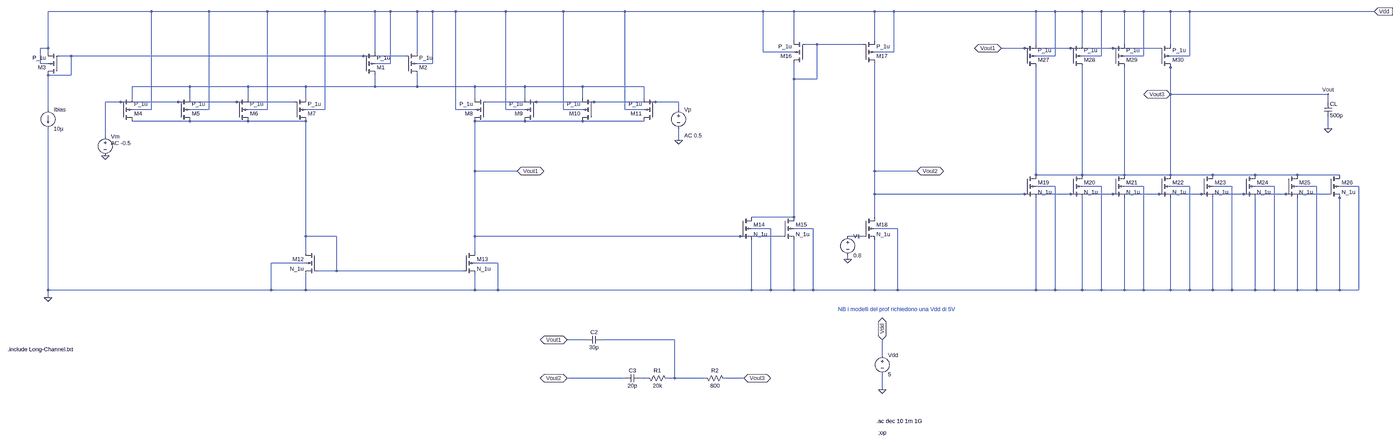
[diagram p0: schematic Three_stage_CMOS_OTA.asc, whole sheet]
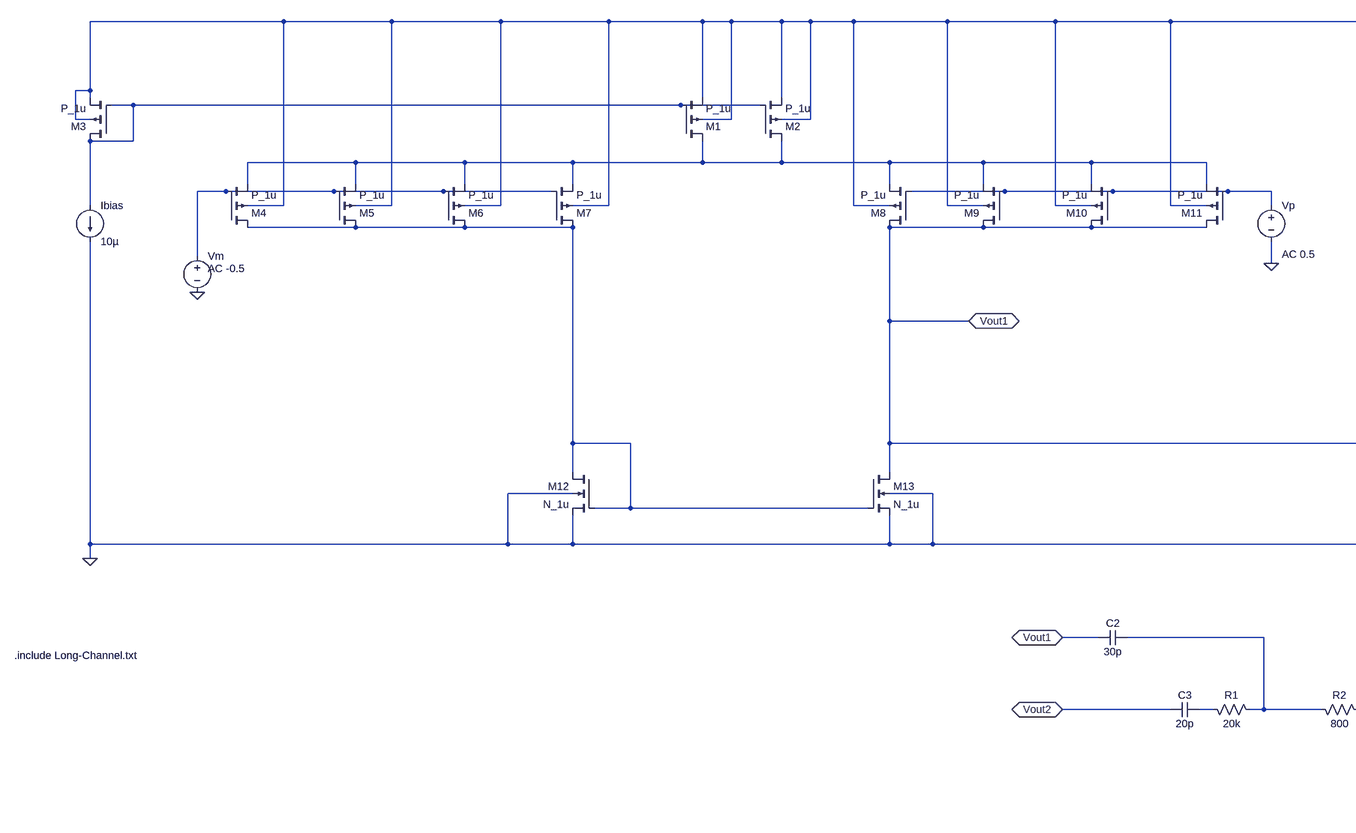
[diagram p1: schematic Three_stage_CMOS_OTA.asc, part, row 1 of 1, column 1 of 2]
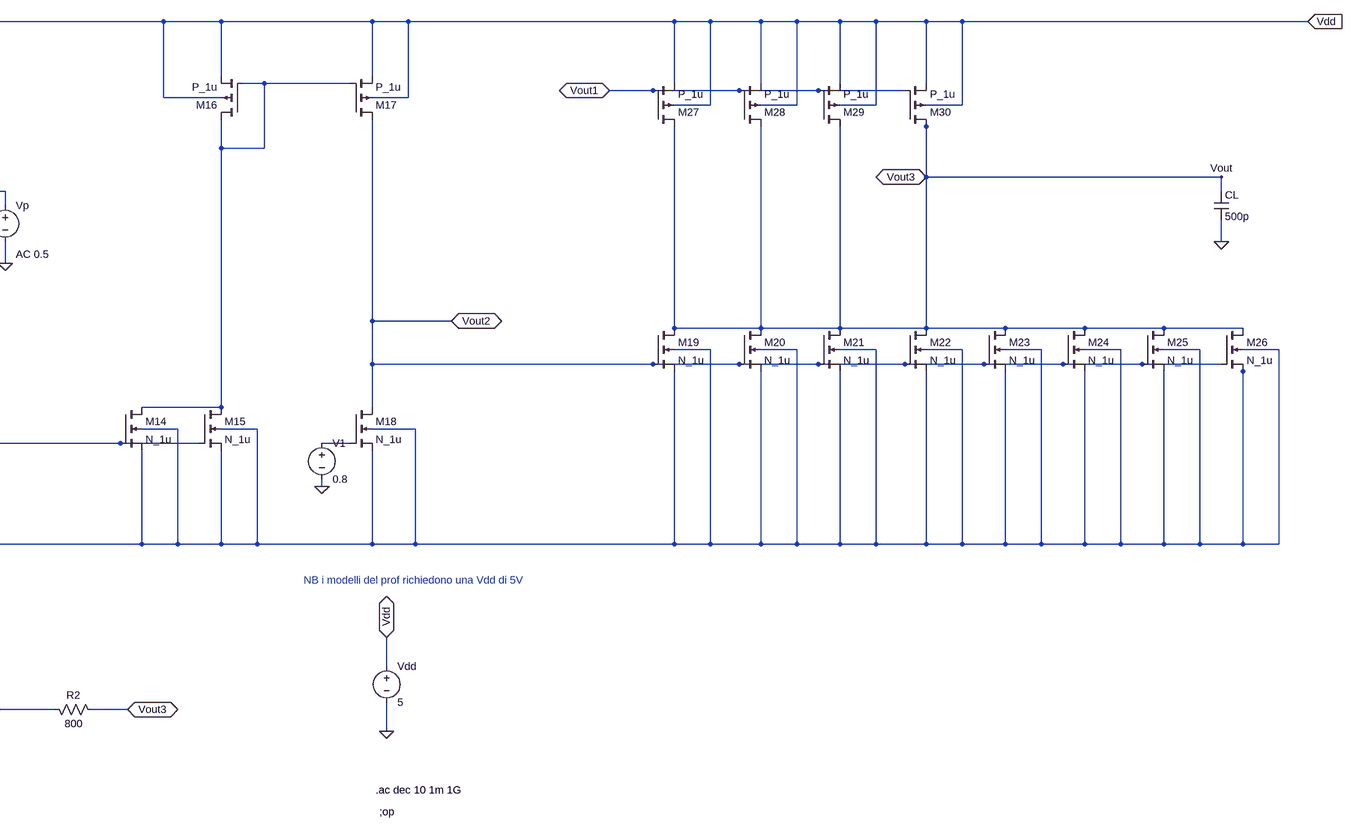
[diagram p2: schematic Three_stage_CMOS_OTA.asc, part, row 1 of 1, column 2 of 2]
Three_stage_CMOS_OTA.asc, the LTspice schematic file:
Version 4
SHEET 1 5820 1952
WIRE -560 -128 -1072 -128
WIRE -320 -128 -560 -128
WIRE -64 -128 -320 -128
WIRE 176 -128 -64 -128
WIRE 384 -128 176 -128
WIRE 448 -128 384 -128
WIRE 560 -128 448 -128
WIRE 624 -128 560 -128
WIRE 720 -128 624 -128
WIRE 928 -128 720 -128
WIRE 1168 -128 928 -128
WIRE 1424 -128 1168 -128
WIRE 2000 -128 1424 -128
WIRE 2128 -128 2000 -128
WIRE 2464 -128 2128 -128
WIRE 2544 -128 2464 -128
WIRE 3136 -128 2544 -128
WIRE 3216 -128 3136 -128
WIRE 3328 -128 3216 -128
WIRE 3408 -128 3328 -128
WIRE 3504 -128 3408 -128
WIRE 3584 -128 3504 -128
WIRE 3696 -128 3584 -128
WIRE 3776 -128 3696 -128
WIRE 4544 -128 3776 -128
WIRE 2128 0 2128 -128
WIRE 2464 0 2464 -128
WIRE 2224 16 2176 16
WIRE 2416 16 2224 16
WIRE 3136 16 3136 -128
WIRE 3328 16 3328 -128
WIRE 3504 16 3504 -128
WIRE 3696 16 3696 -128
WIRE -1072 32 -1072 -128
WIRE -1072 32 -1104 32
WIRE 3088 32 2992 32
WIRE 3280 32 3088 32
WIRE 3456 32 3280 32
WIRE 3648 32 3456 32
WIRE -1072 48 -1072 32
WIRE 384 48 384 -128
WIRE 560 48 560 -128
WIRE 2000 48 2000 -128
WIRE 2128 48 2000 48
WIRE 2544 48 2544 -128
WIRE 2544 48 2464 48
WIRE -976 64 -1024 64
WIRE 336 64 -976 64
WIRE 512 64 336 64
WIRE 3216 64 3216 -128
WIRE 3216 64 3136 64
WIRE 3408 64 3408 -128
WIRE 3408 64 3328 64
WIRE 3584 64 3584 -128
WIRE 3584 64 3504 64
WIRE 3776 64 3776 -128
WIRE 3776 64 3696 64
WIRE -1104 96 -1104 32
WIRE -1072 96 -1104 96
WIRE 448 96 448 -128
WIRE 448 96 384 96
WIRE 624 96 624 -128
WIRE 624 96 560 96
WIRE 3696 112 3696 96
WIRE -976 144 -976 64
WIRE -976 144 -1072 144
WIRE 2128 160 2128 96
WIRE 2224 160 2224 16
WIRE 2224 160 2128 160
WIRE -400 192 -640 192
WIRE -144 192 -400 192
WIRE 96 192 -144 192
WIRE 384 192 384 144
WIRE 384 192 96 192
WIRE 560 192 560 144
WIRE 560 192 384 192
WIRE 800 192 560 192
WIRE 1008 192 800 192
WIRE 1248 192 1008 192
WIRE 1504 192 1248 192
WIRE 3696 224 3696 112
WIRE 4352 224 3696 224
WIRE -640 240 -640 192
WIRE -400 240 -400 192
WIRE -144 240 -144 192
WIRE 96 240 96 192
WIRE 800 240 800 192
WIRE 1008 240 1008 192
WIRE 1248 240 1248 192
WIRE 1504 240 1504 192
WIRE -688 256 -752 256
WIRE -448 256 -688 256
WIRE -192 256 -448 256
WIRE 48 256 -192 256
WIRE 1056 256 848 256
WIRE 1296 256 1056 256
WIRE 1552 256 1296 256
WIRE 1648 256 1552 256
WIRE 4352 256 4352 224
WIRE -1072 288 -1072 144
WIRE -560 288 -560 -128
WIRE -560 288 -640 288
WIRE -320 288 -320 -128
WIRE -320 288 -400 288
WIRE -64 288 -64 -128
WIRE -64 288 -144 288
WIRE 176 288 176 -128
WIRE 176 288 96 288
WIRE 720 288 720 -128
WIRE 800 288 720 288
WIRE 928 288 928 -128
WIRE 1008 288 928 288
WIRE 1168 288 1168 -128
WIRE 1248 288 1168 288
WIRE 1424 288 1424 -128
WIRE 1504 288 1424 288
WIRE 1648 288 1648 256
WIRE -400 336 -640 336
WIRE -144 336 -400 336
WIRE 96 336 -144 336
WIRE 1008 336 800 336
WIRE 1248 336 1008 336
WIRE 1504 336 1248 336
WIRE 4352 368 4352 320
WIRE -752 400 -752 256
WIRE 1648 416 1648 368
WIRE 800 544 800 336
WIRE 976 544 800 544
WIRE 2464 544 2464 96
WIRE 2640 544 2464 544
WIRE 3136 560 3136 112
WIRE 3328 560 3328 112
WIRE 3328 560 3136 560
WIRE 3504 560 3504 112
WIRE 3504 560 3328 560
WIRE 3696 560 3696 224
WIRE 3696 560 3504 560
WIRE 3872 560 3696 560
WIRE 4048 560 3872 560
WIRE 4224 560 4048 560
WIRE 4400 560 4224 560
WIRE 3216 608 3136 608
WIRE 3408 608 3328 608
WIRE 3584 608 3504 608
WIRE 3776 608 3696 608
WIRE 3952 608 3872 608
WIRE 4128 608 4048 608
WIRE 4304 608 4224 608
WIRE 4480 608 4400 608
WIRE 2464 640 2464 544
WIRE 3088 640 2464 640
WIRE 3280 640 3088 640
WIRE 3456 640 3280 640
WIRE 3648 640 3456 640
WIRE 3824 640 3648 640
WIRE 4000 640 3824 640
WIRE 4176 640 4000 640
WIRE 4352 640 4176 640
WIRE 4400 656 4400 640
WIRE 2128 736 2128 160
WIRE 2128 736 1952 736
WIRE 2464 736 2464 640
WIRE 2032 784 1952 784
WIRE 2208 784 2128 784
WIRE 2560 784 2464 784
WIRE 96 816 96 336
WIRE 224 816 96 816
WIRE 800 816 800 544
WIRE 1904 816 800 816
WIRE 2080 816 1904 816
WIRE 2416 816 2352 816
WIRE 96 880 96 816
WIRE 800 880 800 816
WIRE 2352 912 2352 896
WIRE 96 928 -48 928
WIRE 896 928 800 928
WIRE 224 960 224 816
WIRE 224 960 144 960
WIRE 752 960 224 960
WIRE -1072 1040 -1072 368
WIRE -48 1040 -48 928
WIRE -48 1040 -1072 1040
WIRE 96 1040 96 976
WIRE 96 1040 -48 1040
WIRE 800 1040 800 976
WIRE 800 1040 96 1040
WIRE 896 1040 896 928
WIRE 896 1040 800 1040
WIRE 1952 1040 1952 832
WIRE 1952 1040 896 1040
WIRE 2032 1040 2032 784
WIRE 2032 1040 1952 1040
WIRE 2128 1040 2128 832
WIRE 2128 1040 2032 1040
WIRE 2208 1040 2208 784
WIRE 2208 1040 2128 1040
WIRE 2464 1040 2464 832
WIRE 2464 1040 2208 1040
WIRE 2560 1040 2560 784
WIRE 2560 1040 2464 1040
WIRE 3136 1040 3136 656
WIRE 3136 1040 2560 1040
WIRE 3216 1040 3216 608
WIRE 3216 1040 3136 1040
WIRE 3328 1040 3328 656
WIRE 3328 1040 3216 1040
WIRE 3408 1040 3408 608
WIRE 3408 1040 3328 1040
WIRE 3504 1040 3504 656
WIRE 3504 1040 3408 1040
WIRE 3584 1040 3584 608
WIRE 3584 1040 3504 1040
WIRE 3696 1040 3696 656
WIRE 3696 1040 3584 1040
WIRE 3776 1040 3776 608
WIRE 3776 1040 3696 1040
WIRE 3872 1040 3872 656
WIRE 3872 1040 3776 1040
WIRE 3952 1040 3952 608
WIRE 3952 1040 3872 1040
WIRE 4048 1040 4048 656
WIRE 4048 1040 3952 1040
WIRE 4128 1040 4128 608
WIRE 4128 1040 4048 1040
WIRE 4224 1040 4224 656
WIRE 4224 1040 4128 1040
WIRE 4304 1040 4304 608
WIRE 4304 1040 4224 1040
WIRE 4400 1040 4400 656
WIRE 4400 1040 4304 1040
WIRE 4480 1040 4480 608
WIRE 4480 1040 4400 1040
WIRE -1072 1072 -1072 1040
WIRE 1264 1248 1184 1248
WIRE 1632 1248 1328 1248
WIRE 2496 1312 2496 1248
WIRE 1424 1408 1184 1408
WIRE 1520 1408 1488 1408
WIRE 1632 1408 1632 1248
WIRE 1632 1408 1600 1408
WIRE 1760 1408 1632 1408
WIRE 1920 1408 1840 1408
WIRE 2496 1456 2496 1392
FLAG -1072 1072 0
FLAG 976 544 Vout1
IOPIN 976 544 BiDir
FLAG 2640 544 Vout2
IOPIN 2640 544 BiDir
FLAG 2992 32 Vout1
IOPIN 2992 32 BiDir
FLAG 4544 -128 Vdd
IOPIN 4544 -128 In
FLAG 4352 368 0
FLAG 1920 1408 Vout3
IOPIN 1920 1408 BiDir
FLAG 1184 1248 Vout1
IOPIN 1184 1248 BiDir
FLAG 1184 1408 Vout2
IOPIN 1184 1408 BiDir
FLAG 2496 1456 0
FLAG 2496 1248 Vdd
IOPIN 2496 1248 BiDir
FLAG 2352 912 0
FLAG 1648 416 0
FLAG 3696 224 Vout3
IOPIN 3696 224 BiDir
FLAG 4352 224 Vout
FLAG -752 480 0
SYMBOL pmos4 -1024 144 R180
SYMATTR InstName M3
SYMATTR Value2 l=1.65u w=66u
SYMATTR Value P_1u
SYMBOL current -1072 288 R0
WINDOW 123 0 0 Left 0
WINDOW 39 0 0 Left 0
SYMATTR InstName Ibias
SYMATTR Value 10µ
SYMBOL pmos4 848 336 R180
SYMATTR InstName M8
SYMATTR Value2 l=1.65u w=66u
SYMATTR Value P_1u
SYMBOL nmos4 144 880 M0
SYMATTR InstName M12
SYMATTR Value2 l=1.2u w=68.6u
SYMATTR Value N_1u
SYMBOL nmos4 752 880 R0
SYMATTR InstName M13
SYMATTR Value2 l=1.2u w=68.6u
SYMATTR Value N_1u
SYMBOL nmos4 1904 736 R0
SYMATTR InstName M14
SYMATTR Value2 l=1.2u w=68.6u
SYMATTR Value N_1u
SYMBOL pmos4 2176 96 R180
SYMATTR InstName M16
SYMATTR Value2 l=1.2u w=85.7u
SYMATTR Value P_1u
SYMBOL pmos4 2416 96 M180
SYMATTR InstName M17
SYMATTR Value2 l=1.2u w=85.7u
SYMATTR Value P_1u
SYMBOL nmos4 2416 736 R0
SYMATTR InstName M18
SYMATTR Value2 l=1.65u w=66u
SYMATTR Value N_1u
SYMBOL pmos4 336 144 M180
SYMATTR InstName M1
SYMATTR Value2 l=1.65u w=66u
SYMATTR Value P_1u
SYMBOL pmos4 512 144 M180
SYMATTR InstName M2
SYMATTR Value2 l=1.65u w=66u
SYMATTR Value P_1u
SYMBOL cap 4336 256 R0
SYMATTR InstName CL
SYMATTR Value 500p
SYMBOL cap 1328 1232 R90
WINDOW 0 0 32 VBottom 2
WINDOW 3 32 32 VTop 2
SYMATTR InstName C2
SYMATTR Value 30p
SYMBOL cap 1488 1392 R90
WINDOW 0 0 32 VBottom 2
WINDOW 3 32 32 VTop 2
SYMATTR InstName C3
SYMATTR Value 20p
SYMBOL res 1504 1392 M90
WINDOW 0 0 56 VBottom 2
WINDOW 3 32 56 VTop 2
SYMATTR InstName R1
SYMATTR Value 20k
SYMBOL res 1744 1392 M90
WINDOW 0 0 56 VBottom 2
WINDOW 3 32 56 VTop 2
SYMATTR InstName R2
SYMATTR Value 800
SYMBOL voltage 2496 1296 R0
WINDOW 123 0 0 Left 0
WINDOW 39 0 0 Left 0
SYMATTR InstName Vdd
SYMATTR Value 5
SYMBOL voltage 2352 800 R0
WINDOW 123 0 0 Left 0
WINDOW 39 0 0 Left 0
SYMATTR InstName V1
SYMATTR Value 0.8
SYMBOL voltage -752 384 R0
WINDOW 123 24 44 Left 2
WINDOW 39 0 0 Left 0
SYMATTR Value2 AC -0.5
SYMATTR InstName Vm
SYMATTR Value ""
SYMBOL voltage 1648 272 R0
WINDOW 123 24 124 Left 2
WINDOW 39 0 0 Left 0
SYMATTR Value2 AC 0.5
SYMATTR InstName Vp
SYMATTR Value ""
SYMBOL pmos4 -688 336 M180
SYMATTR InstName M4
SYMATTR Value2 l=1.65u w=66u
SYMATTR Value P_1u
SYMBOL pmos4 -448 336 M180
SYMATTR InstName M5
SYMATTR Value2 l=1.65u w=66u
SYMATTR Value P_1u
SYMBOL pmos4 -192 336 M180
SYMATTR InstName M6
SYMATTR Value2 l=1.65u w=66u
SYMATTR Value P_1u
SYMBOL pmos4 48 336 M180
SYMATTR InstName M7
SYMATTR Value2 l=1.65u w=66u
SYMATTR Value P_1u
SYMBOL pmos4 1056 336 R180
SYMATTR InstName M9
SYMATTR Value2 l=1.65u w=66u
SYMATTR Value P_1u
SYMBOL pmos4 1296 336 R180
SYMATTR InstName M10
SYMATTR Value2 l=1.65u w=66u
SYMATTR Value P_1u
SYMBOL pmos4 1552 336 R180
SYMATTR InstName M11
SYMATTR Value2 l=1.65u w=66u
SYMATTR Value P_1u
SYMBOL nmos4 2080 736 R0
SYMATTR InstName M15
SYMATTR Value2 l=1.2u w=68.6u
SYMATTR Value N_1u
SYMBOL nmos4 3088 560 R0
SYMATTR InstName M19
SYMATTR Value2 l=1.2u w=68.6u
SYMATTR Value N_1u
SYMBOL nmos4 3280 560 R0
SYMATTR InstName M20
SYMATTR Value2 l=1.2u w=68.6u
SYMATTR Value N_1u
SYMBOL nmos4 3456 560 R0
SYMATTR InstName M21
SYMATTR Value2 l=1.2u w=68.6u
SYMATTR Value N_1u
SYMBOL nmos4 3648 560 R0
SYMATTR InstName M22
SYMATTR Value2 l=1.2u w=68.6u
SYMATTR Value N_1u
SYMBOL nmos4 3824 560 R0
SYMATTR InstName M23
SYMATTR Value2 l=1.2u w=68.6u
SYMATTR Value N_1u
SYMBOL nmos4 4000 560 R0
SYMATTR InstName M24
SYMATTR Value2 l=1.2u w=68.6u
SYMATTR Value N_1u
SYMBOL nmos4 4176 560 R0
SYMATTR InstName M25
SYMATTR Value2 l=1.2u w=68.6u
SYMATTR Value N_1u
SYMBOL nmos4 4352 560 R0
SYMATTR InstName M26
SYMATTR Value2 l=1.2u w=68.6u
SYMATTR Value N_1u
SYMBOL pmos4 3088 112 M180
SYMATTR InstName M27
SYMATTR Value2 l=1.2u w=68.6u
SYMATTR Value P_1u
SYMBOL pmos4 3280 112 M180
SYMATTR InstName M28
SYMATTR Value2 l=1.2u w=68.6u
SYMATTR Value P_1u
SYMBOL pmos4 3456 112 M180
SYMATTR InstName M29
SYMATTR Value2 l=1.2u w=68.6u
SYMATTR Value P_1u
SYMBOL pmos4 3648 112 M180
SYMATTR InstName M30
SYMATTR Value2 l=1.2u w=68.6u
SYMATTR Value P_1u
TEXT 2472 1592 Left 2 !.ac dec 10 1m 1G
TEXT 2480 1640 Left 2 !;op
TEXT 2312 1120 Left 2 ;NB i modelli del prof richiedono una Vdd di 5V
TEXT -1240 1288 Left 2 !.include Long-Channel.txt

The netlist it stands for:
* Three_stage_CMOS_OTA.asc
M3 N002 N002 Vdd Vdd P_1u l=1.65u w=66u
Ibias N002 0 10µ
M8 Vout1 N005 N003 Vdd P_1u l=1.65u w=66u
M12 N006 N006 0 0 N_1u l=1.2u w=68.6u
M13 Vout1 N006 0 0 N_1u l=1.2u w=68.6u
M14 N001 Vout1 0 0 N_1u l=1.2u w=68.6u
M16 N001 N001 Vdd Vdd P_1u l=1.2u w=85.7u
M17 Vout2 N001 Vdd Vdd P_1u l=1.2u w=85.7u
M18 Vout2 N007 0 0 N_1u l=1.65u w=66u
M1 N003 N002 Vdd Vdd P_1u l=1.65u w=66u
M2 N003 N002 Vdd Vdd P_1u l=1.65u w=66u
CL Vout 0 500p
C2 N008 Vout1 30p
C3 N009 Vout2 20p
R1 N009 N008 20k
R2 N008 Vout 800
Vdd Vdd 0 5
V1 N007 0 0.8
Vm N004 0 AC -0.5
Vp N005 0 AC 0.5
M4 N006 N004 N003 Vdd P_1u l=1.65u w=66u
M5 N006 N004 N003 Vdd P_1u l=1.65u w=66u
M6 N006 N004 N003 Vdd P_1u l=1.65u w=66u
M7 N006 N004 N003 Vdd P_1u l=1.65u w=66u
M9 Vout1 N005 N003 Vdd P_1u l=1.65u w=66u
M10 Vout1 N005 N003 Vdd P_1u l=1.65u w=66u
M11 Vout1 N005 N003 Vdd P_1u l=1.65u w=66u
M15 N001 Vout1 0 0 N_1u l=1.2u w=68.6u
M19 Vout Vout2 0 0 N_1u l=1.2u w=68.6u
M20 Vout Vout2 0 0 N_1u l=1.2u w=68.6u
M21 Vout Vout2 0 0 N_1u l=1.2u w=68.6u
M22 Vout Vout2 0 0 N_1u l=1.2u w=68.6u
M23 Vout Vout2 0 0 N_1u l=1.2u w=68.6u
M24 Vout Vout2 0 0 N_1u l=1.2u w=68.6u
M25 Vout Vout2 0 0 N_1u l=1.2u w=68.6u
M26 Vout Vout2 0 0 N_1u l=1.2u w=68.6u
M27 Vout Vout1 Vdd Vdd P_1u l=1.2u w=68.6u
M28 Vout Vout1 Vdd Vdd P_1u l=1.2u w=68.6u
M29 Vout Vout1 Vdd Vdd P_1u l=1.2u w=68.6u
M30 Vout Vout1 Vdd Vdd P_1u l=1.2u w=68.6u
.model NMOS NMOS
.model PMOS PMOS
.lib standard.mos
.ac dec 10 1m 1G
;op
* NB i modelli del prof richiedono una Vdd di 5V
.include Long-Channel.txt
.backanno
.end